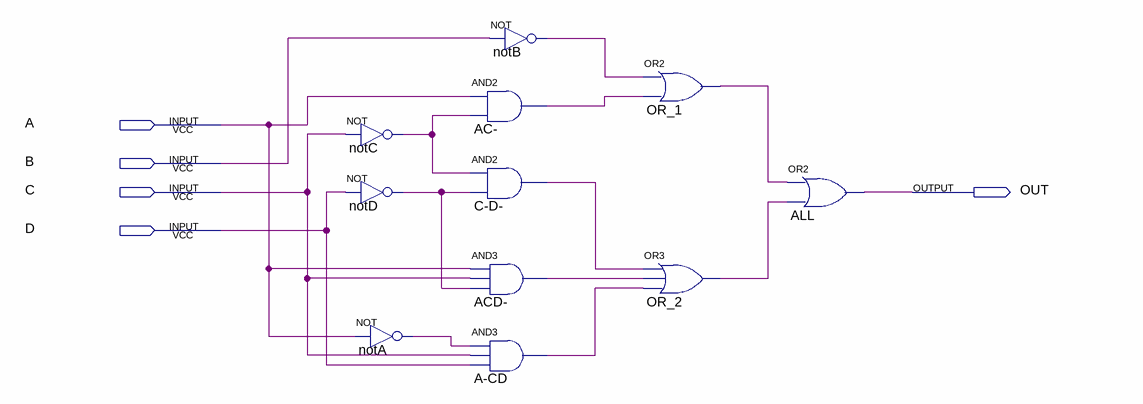
[diagram p0: schematic sheet]
// Quartus schematic b.bdf as structural Verilog: 11 symbols, 5 pins
module b (
  input  A,
  input  B,
  input  C,
  input  D,
  output OUT
);

  wire A_CD_out, AC__out, ACD__out, C_D__out, notA_out, notB_out, notC_out, notD_out, OR_1_out, OR_2_out;

  not notC (notC_out, C);
  not notD (notD_out, D);
  not notA (notA_out, A);
  not notB (notB_out, B);
  and \AC-  (AC__out, A, notC_out);
  and \C-D-  (C_D__out, notC_out, notD_out);
  and \ACD-  (ACD__out, A, C, notD_out);
  and \A-CD  (A_CD_out, notA_out, C, D);
  or OR_1 (OR_1_out, notB_out, AC__out);
  or OR_2 (OR_2_out, C_D__out, ACD__out, A_CD_out);
  or ALL (OUT, OR_1_out, OR_2_out);
endmodule
